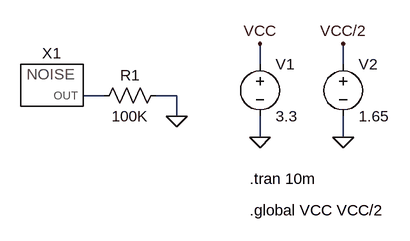
[diagram p0: schematic test_noise.asc]
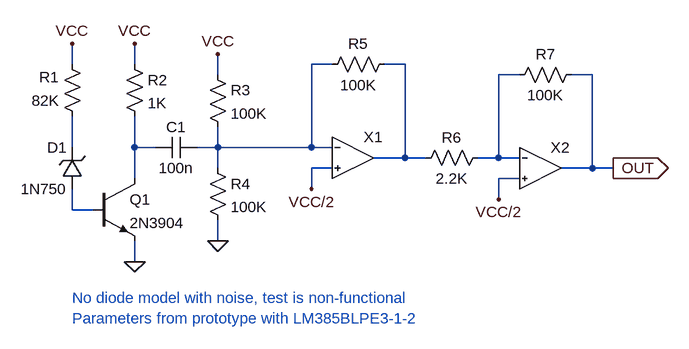
[diagram p1: sub-circuit noise.asc]
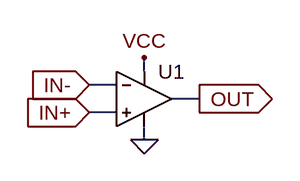
[diagram p2: sub-circuit opamp.asc]
test_noise.asc, the LTspice schematic file:
Version 4
SHEET 1 1908 736
WIRE 640 320 640 288
WIRE 768 320 768 288
WIRE 400 368 368 368
WIRE 512 368 480 368
WIRE 512 400 512 368
WIRE 640 432 640 400
WIRE 768 432 768 400
FLAG 640 432 0
FLAG 768 432 0
FLAG 640 288 VCC
FLAG 768 288 VCC/2
FLAG 512 400 0
SYMBOL voltage 640 304 R0
WINDOW 123 0 0 Left 0
WINDOW 39 0 0 Left 0
SYMATTR InstName V1
SYMATTR Value 3.3
SYMBOL voltage 768 304 R0
WINDOW 123 0 0 Left 0
WINDOW 39 0 0 Left 0
SYMATTR InstName V2
SYMATTR Value 1.65
SYMBOL noise 368 368 R0
SYMATTR InstName X1
SYMBOL res 496 352 R90
WINDOW 0 0 56 VBottom 2
WINDOW 3 32 56 VTop 2
SYMATTR InstName R1
SYMATTR Value 100K
TEXT 624 496 Left 2 !.tran 10m
TEXT 624 544 Left 2 !.global VCC VCC/2

noise.asc, the sub-circuit schematic file:
Version 4
SHEET 1 912 680
WIRE -240 16 -240 -16
WIRE -144 16 -144 -16
WIRE 160 16 128 16
WIRE 272 16 240 16
WIRE -16 32 -16 0
WIRE 448 32 416 32
WIRE 560 32 528 32
WIRE -240 144 -240 96
WIRE -144 144 -144 96
WIRE -112 144 -144 144
WIRE -16 144 -16 112
WIRE -16 144 -48 144
WIRE 128 144 128 16
WIRE 128 144 -16 144
WIRE 160 144 128 144
WIRE 272 160 272 16
WIRE 272 160 224 160
WIRE 304 160 272 160
WIRE 416 160 416 32
WIRE 416 160 384 160
WIRE 448 160 416 160
WIRE -16 176 -16 144
WIRE 160 176 128 176
WIRE 560 176 560 32
WIRE 560 176 512 176
WIRE 592 176 560 176
WIRE -144 192 -144 144
WIRE 448 192 416 192
WIRE 128 208 128 176
WIRE 416 224 416 192
WIRE -240 240 -240 208
WIRE -208 240 -240 240
WIRE -16 288 -16 256
WIRE -144 320 -144 288
FLAG -240 -16 VCC
FLAG -16 288 0
FLAG -16 0 VCC
FLAG 128 208 VCC/2
FLAG -144 320 0
FLAG -144 -16 VCC
FLAG 416 224 VCC/2
FLAG 592 176 OUT
IOPIN 592 176 Out
SYMBOL zener -224 208 R180
WINDOW 0 24 64 Left 2
WINDOW 3 24 0 Left 2
SYMATTR InstName D1
SYMATTR Value 1N750
SYMBOL res -224 112 R180
WINDOW 0 36 76 Left 2
WINDOW 3 36 40 Left 2
SYMATTR InstName R1
SYMATTR Value 82K
SYMBOL cap -48 128 R90
WINDOW 0 0 32 VBottom 2
WINDOW 3 32 32 VTop 2
SYMATTR InstName C1
SYMATTR Value 100n
SYMBOL res -32 160 R0
SYMATTR InstName R4
SYMATTR Value 100K
SYMBOL res -32 16 R0
SYMATTR InstName R3
SYMATTR Value 100K
SYMBOL res 256 0 R90
WINDOW 0 0 56 VBottom 2
WINDOW 3 32 56 VTop 2
SYMATTR InstName R5
SYMATTR Value 100K
SYMBOL npn -208 192 R0
SYMATTR InstName Q1
SYMATTR Value 2N3904
SYMBOL res -160 0 R0
SYMATTR InstName R2
SYMATTR Value 1K
SYMBOL res 400 144 R90
WINDOW 0 0 56 VBottom 2
WINDOW 3 32 56 VTop 2
SYMATTR InstName R6
SYMATTR Value 2.2K
SYMBOL res 544 16 R90
WINDOW 0 0 56 VBottom 2
WINDOW 3 32 56 VTop 2
SYMATTR InstName R7
SYMATTR Value 100K
SYMBOL opamp 192 160 R0
SYMATTR InstName X1
SYMBOL opamp 480 176 R0
SYMATTR InstName X2
TEXT -240 376 Left 2 ;No diode model with noise, test is non-functional\nParameters from prototype with LM385BLPE3-1-2

opamp.asc, the sub-circuit schematic file:
Version 4
SHEET 1 880 680
WIRE 144 144 144 128
WIRE 112 160 80 160
WIRE 208 176 176 176
WIRE 112 192 80 192
WIRE 144 224 144 208
FLAG 144 224 0
FLAG 144 128 VCC
FLAG 208 176 OUT
IOPIN 208 176 Out
FLAG 80 192 IN+
IOPIN 80 192 In
FLAG 80 160 IN-
IOPIN 80 160 In
SYMBOL Opamps\\UniversalOpamp2 144 176 R0
SYMATTR InstName U1
SYMATTR Value2 Avol=1Meg GBW=1.2Meg Slew=10Meg

The netlist it stands for:
* test_noise.asc
V1 VCC 0 3.3
V2 VCC/2 0 1.65
XX1 N001 noise
R1 0 N001 100K

* block symbol definitions
.subckt noise OUT
D1 N006 N004 1N750
R1 N004 VCC 82K
C1 N001 N005 100n
R4 N001 0 100K
R3 VCC N001 100K
R5 N002 N001 100K
Q1 N005 N006 0 0 2N3904
R2 VCC N005 1K
R6 N003 N002 2.2K
R7 OUT N003 100K
XX1 VCC/2 N001 N002 opamp
XX2 VCC/2 N003 OUT opamp
* No diode model with noise, test is non-functional
* Parameters from prototype with LM385BLPE3-1-2
.ends noise

.subckt opamp IN+ IN- OUT
XU1 IN+ IN- VCC 0 OUT level.2 Avol=1Meg GBW=1.2Meg Slew=10Meg ilimit=25m rail=0 Vos=0 phimargin=45 en=0 enk=0 in=0 ink=0 Rin=500Meg  ; pins IN+ IN- V+ V- OUT
.ends opamp

.model D D
.lib standard.dio
.model NPN NPN
.model PNP PNP
.lib standard.bjt
.tran 10m
.global VCC VCC/2
.lib UniversalOpamps2.sub
.backanno
.end